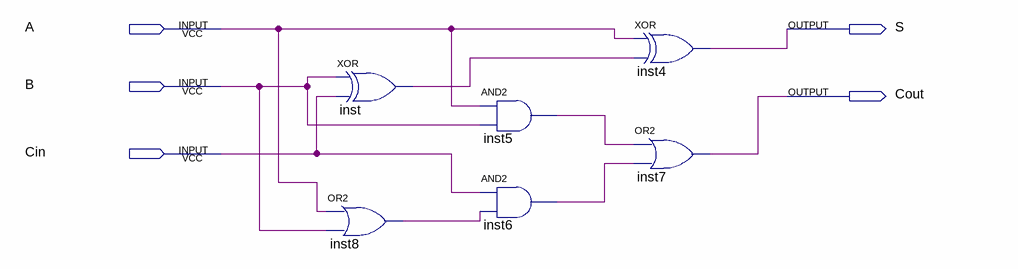
[diagram p0: schematic sheet]
// Quartus schematic Soma-1-bit.bdf as structural Verilog: 6 symbols, 5 pins
module \Soma-1-bit  (
  input  A,
  input  B,
  input  Cin,
  output S,
  output Cout
);

  wire inst5_out, inst6_out, inst8_out, inst_out;

  xor inst (inst_out, B, Cin);
  or inst8 (inst8_out, A, B);
  and inst5 (inst5_out, A, B);
  and inst6 (inst6_out, Cin, inst8_out);
  xor inst4 (S, A, inst_out);
  or inst7 (Cout, inst5_out, inst6_out);
endmodule
